# EAGLE schematic Dual Motor Driver (EAGLE 6.4)
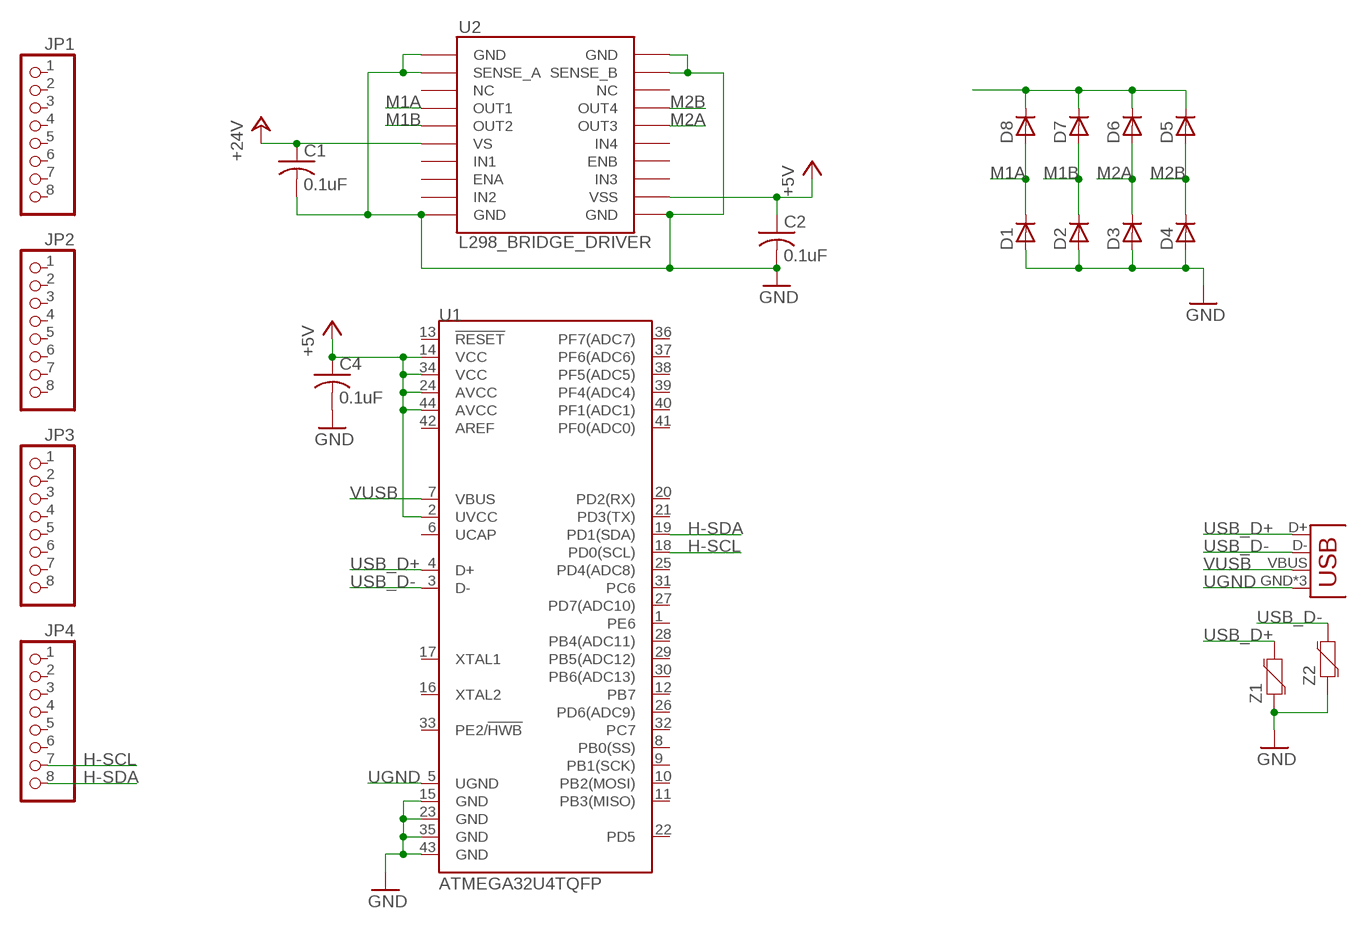
[diagram p0: schematic, sheet 1]

## Parts
C1  0.1uF  C-USC0603  [C0603]
C2  0.1uF  C-USC0603  [C0603]
C4  0.1uF  C-USC0603  [C0603]
D1  D-SOD123  [SOD123]
D2  D-SOD123  [SOD123]
D3  D-SOD123  [SOD123]
D4  D-SOD123  [SOD123]
D5  D-SOD123  [SOD123]
D6  D-SOD123  [SOD123]
D7  D-SOD123  [SOD123]
D8  D-SOD123  [SOD123]
JP1  PINHD-1X81X08_NO_SILK  [1X08_NO_SS]
JP2  PINHD-1X81X08_NO_SILK  [1X08_NO_SS]
JP3  PINHD-1X81X08_NO_SILK  [1X08_NO_SS]
JP4  PINHD-1X81X08_NO_SILK  [1X08_NO_SS]
JP5  USB-MICROB  [USB-MICROB]
U1  ATMEGA32U4TQFP  [SPARKFUN-DIGITALIC_TQFP44]
U2  L298_BRIDGE_DRIVER  [POWERSO20]
Z1  VARISTOR-0603  [0603-RES]
Z2  VARISTOR-0603  [0603-RES]

## Nets
+5V: C2.1 C4.1 U1.2(UVCC) U1.14(VCC) U1.24(AVCC) U1.34(VCC) U1.44(AVCC) U2.12(VSS)
+24V: C1.1 U2.6(VS)
GND: C1.2 C2.2 C4.2 D1.2(A) D2.2(A) D3.2(A) D4.2(A) U1.15(GND) U1.23(GND) U1.35(GND) U1.43(GND) U2.1(GND) U2.2(SENSE_A) U2.10(GND) U2.11(GND) U2.19(SENSE_B) U2.20(GND) Z1.1 Z2.1
H-SCL: JP4.7 U1.18(PD0(SCL))
H-SDA: JP4.8 U1.19(PD1(SDA))
M1A: D1.1(C) D8.2(A) U2.4(OUT1)
M1B: D2.1(C) D7.2(A) U2.5(OUT2)
M2A: D3.1(C) D6.2(A) U2.16(OUT3)
M2B: D4.1(C) D5.2(A) U2.17(OUT4)
UGND: JP5.GND JP5.MT1(GND) JP5.MT2(GND) U1.5(UGND)
USB_D+: JP5.D+ U1.4(D+) Z1.2
USB_D-: JP5.D- U1.3(D-) Z2.2
VIN: D5.1(C) D6.1(C) D7.1(C) D8.1(C)
VUSB: JP5.VBUS U1.7(VBUS)
Unconnected: JP1.1 JP1.2 JP1.3 JP1.4 JP1.5 JP1.6 JP1.7 JP1.8 JP2.1 JP2.2 JP2.3 JP2.4 JP2.5 JP2.6 JP2.7 JP2.8 JP3.1 JP3.2 JP3.3 JP3.4 JP3.5 JP3.6 JP3.7 JP3.8 JP4.1 JP4.2 JP4.3 JP4.4 JP4.5 JP4.6 U1.1(PE6) U1.6(UCAP) U1.8(PB0(SS)) U1.9(PB1(SCK)) U1.10(PB2(MOSI)) U1.11(PB3(MISO)) U1.12(PB7) U1.13(!RESET) U1.16(XTAL2) U1.17(XTAL1) U1.20(PD2(RX)) U1.21(PD3(TX)) U1.22(PD5) U1.25(PD4(ADC8)) U1.26(PD6(ADC9)) U1.27(PD7(ADC10)) U1.28(PB4(ADC11)) U1.29(PB5(ADC12)) U1.30(PB6(ADC13)) U1.31(PC6) U1.32(PC7) U1.33(PE2/!HWB) U1.36(PF7(ADC7)) U1.37(PF6(ADC6)) U1.38(PF5(ADC5)) U1.39(PF4(ADC4)) U1.40(PF1(ADC1)) U1.41(PF0(ADC0)) U1.42(AREF) U2.3(NC) U2.7(IN1) U2.8(ENA) U2.9(IN2) U2.13(IN3) U2.14(ENB) U2.15(IN4) U2.18(NC)

## Library data of the parts
C1 C2 C4 = resistor:C-US: CAPACITOR, American symbol
D1-D8 = semicon-smd-ipc:D-: DIODE unfilled; PART#: CDBW140-G
JP1-JP4 = pinhead:PINHD-1X8: PIN HEADER
JP5 = SparkFun-Connectors:USB: USB Connectors USB-B-PTH is fully proven SKU : PRT-00139/CONN-08278 USB-miniB is fully proven SKU : PRT-00587 USB-A-PCB is untested. USB-A-H is throughly reviewed, but untested. Spark Fun Electronics SKU : PRT-00437 USB-B-SMT is throughly reviewed, but untested. Needs silkscreen touching up. USB-A-S has not been used/tested USB-MB-H has not been used/tested USB-MICROB has been used. CONN-09505; PROD_ID: CONN-09505
U1 = SparkFun-DigitalIC:ATMEGA32U4: Atmel 44-pin 8-bit Microcontroller with 32KBytes of ISP Flash and USB Controller
U2 = SparkFun-PowerIC:L298_BRIDGE_DRIVER: Full-bridge power driver IC
Z1 Z2 = SparkFun-DiscreteSemi:VARISTOR: Varistor Varistor (Variable resistor) is a nonlinear resistive element of the voltage dependence that resistance changes with applied voltage. Varistor is equivalent with Zener diode of two series connection.; PART#: CG0603MLC-05E